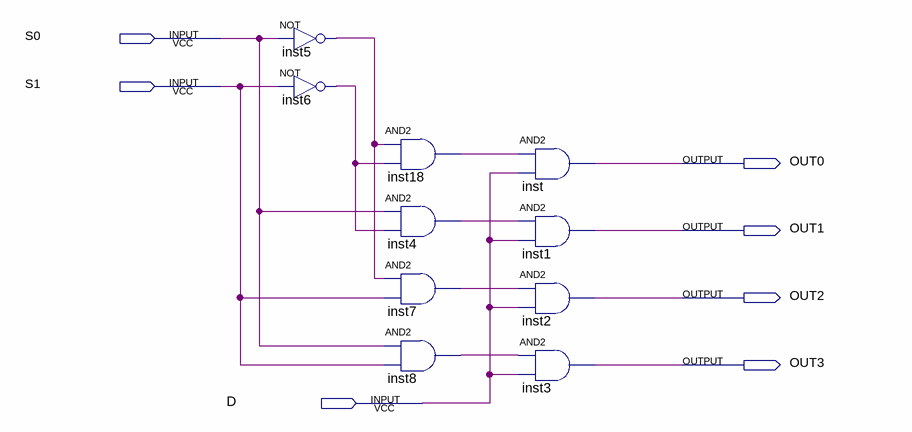
[diagram p0: schematic sheet]
// Quartus schematic D-multiplexer.bdf as structural Verilog: 10 symbols, 7 pins
module \D-multiplexer  (
  input  S0,
  input  S1,
  input  D,
  output OUT0,
  output OUT1,
  output OUT2,
  output OUT3
);

  wire inst4_out, inst5_out, inst6_out, inst7_out, inst8_out, inst18_out;

  not inst5 (inst5_out, S0);
  not inst6 (inst6_out, S1);
  and inst18 (inst18_out, inst5_out, inst6_out);
  and inst4 (inst4_out, S0, inst6_out);
  and inst7 (inst7_out, inst5_out, S1);
  and inst8 (inst8_out, S0, S1);
  and inst (OUT0, inst18_out, D);
  and inst1 (OUT1, inst4_out, D);
  and inst2 (OUT2, inst7_out, D);
  and inst3 (OUT3, inst8_out, D);
endmodule
